# EAGLE design sensor (EAGLE 6.1)
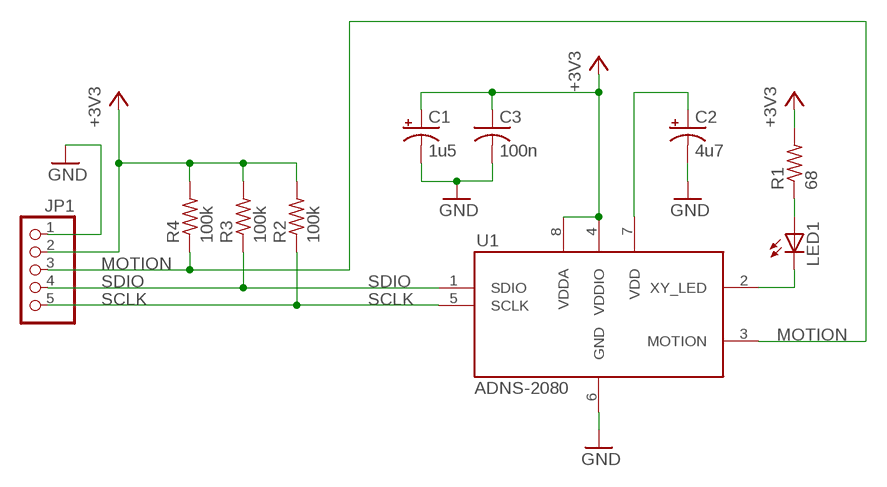
[diagram p0: schematic, sheet 1]

## Parts
C1  1u5  CPOL-USE2.5-5  [E2,5-5]
C2  4u7  CPOL-USE2.5-5  [E2,5-5]
C3  100n  C-US025-025X050  [C025-025X050]
JP1  PINHD-1X5  [1X05]
LED1  LED5MM  [LED5MM]
R1  68  R-US_0207/7  [0207/7]
R2  100k  R-US_0204/5  [0204/5]
R3  100k  R-US_0204/5  [0204/5]
R4  100k  R-US_0204/5  [0204/5]
U1  ADNS-2080  [DIP8-OPTICAL]

## Nets
+3V3: C1.+ C3.1 JP1.2 R1.2 R2.2 R3.2 R4.2 U1.4(VDDIO) U1.8(VDDA)
GND: C1.- C2.- C3.2 JP1.1 U1.6(GND)
MOTION: JP1.3 R4.1 U1.3(MOTION)
N$2: C2.+ U1.7(VDD)
N$5: LED1.A R1.1
N$6: LED1.K(C) U1.2(XY_LED)
SCLK: JP1.5 R2.1 U1.5(SCLK)
SDIO: JP1.4 R3.1 U1.1(SDIO)

## Library data of the parts
C1 C2 = rcl:CPOL-US: POLARIZED CAPACITOR, American symbol
C3 = rcl:C-US: CAPACITOR, American symbol
JP1 = pinhead:PINHD-1X5: PIN HEADER
LED1 = led:LED: LED OSRAM: - CHIPLED LG R971, LG N971, LY N971, LG Q971, LY Q971, LO R971, LY R971 LH N974, LH R974 LS Q976, LO Q976, LY Q976 LO Q996 - Hyper CHIPLED LW Q18S LB Q993, LB Q99A, LB R99A - SideLED LS A670, LO A670, LY A670, LG A670, LP A670 LB A673, LV A673, LT A673, LW A673 LH A674 LY A675 LS A676, LA A676, LO A676, LY A676, LW A676 LS A679, LY A679, LG A679 - Hyper Micro SIDELED® LS Y876, LA Y876, LO Y876, LY Y876 LT Y87S - SmartLED LW L88C, LW L88S LB L89C, LB L89S, LG L890 LS L89K, LO L89K, LY L89K LS L896, LA L896, LO L896, LY L896 - TOPLED LS T670, LO T670, LY T670, LG T670, LP T670 LSG T670, LSP T670, LSY T670, LOP T670, LYG T670 LG T671, LOG T671, LSG T671 LB T673, LV T673, LT T673, LW T673 LH T674 LS T676, LA T676, LO T676, LY T676, LB T676, LH T676, LSB T676, LW T676 LB T67C, LV T67C, LT T67C, LS T67K, LO T67K, LY T67K, LW E67C LS E67B, LA E67B, LO E67B, LY E67B, LB E67C, LV E67C, LT E67C LW T67C LS T679, LY T679, LG T679 LS T770, LO T770, LY T770, LG T770, LP T770 LB T773, LV T773, LT T773, LW T773 LH T774 LS E675, LA E675, LY E675, LS T675 LS T776, LA T776, LO T776, LY T776, LB T776 LHGB T686 LT T68C, LB T68C - Hyper Mini TOPLED® LB M676 - Mini TOPLED Santana® LG M470 LS M47K, LO M47K, LY M47K Source: http://www.osram.convergy.de LUXEON: - LUMILED® LXK2-PW12-R00, LXK2-PW12-S00, LXK2-PW14-U00, LXK2-PW14-V00 LXK2-PM12-R00, LXK2-PM12-S00, LXK2-PM14-U00 LXK2-PE12-Q00, LXK2-PE12-R00, LXK2-PE12-S00, LXK2-PE14-T00, LXK2-PE14-U00 LXK2-PB12-K00, LXK2-PB12-L00, LXK2-PB12-M00, LXK2-PB14-N00, LXK2-PB14-P00, LXK2-PB14-Q00 LXK2-PR12-L00, LXK2-PR12-M00, LXK2-PR14-Q00, LXK2-PR14-R00 LXK2-PD12-Q00, LXK2-PD12-R00, LXK2-PD12-S00 LXK2-PH12-R00, LXK2-PH12-S00 LXK2-PL12-P00, LXK2-PL12-Q00, LXK2-PL12-R00 Source: www.luxeon.com KINGBRIGHT: KA-3528ASYC Source: www.kingbright.com
R1-R4 = rcl:R-US_: RESISTOR, American symbol
U1 = avago_local:ADNS-2080

## Board
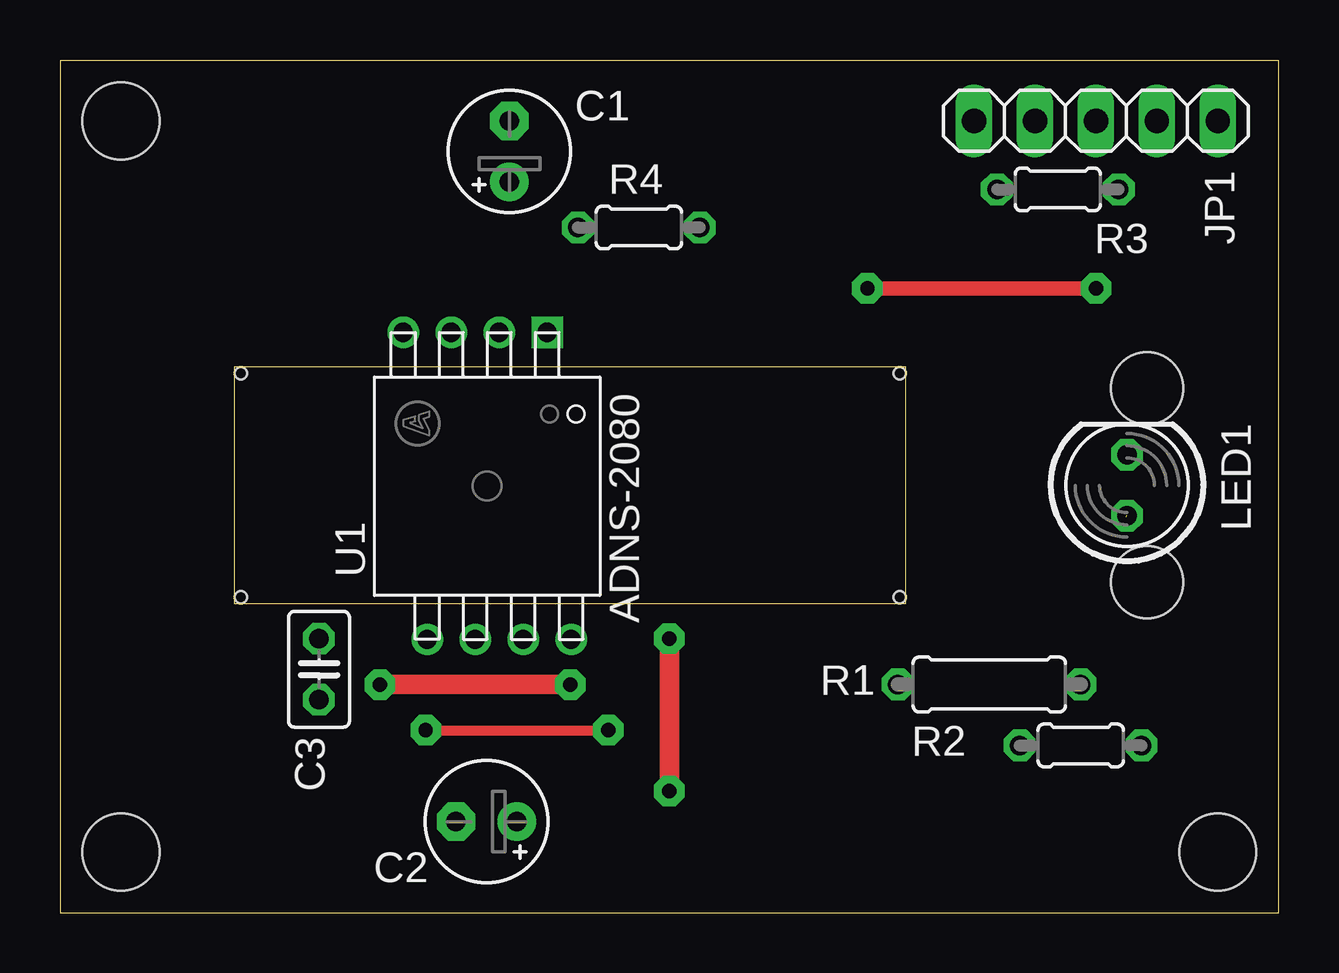
[diagram p1: board, top side]
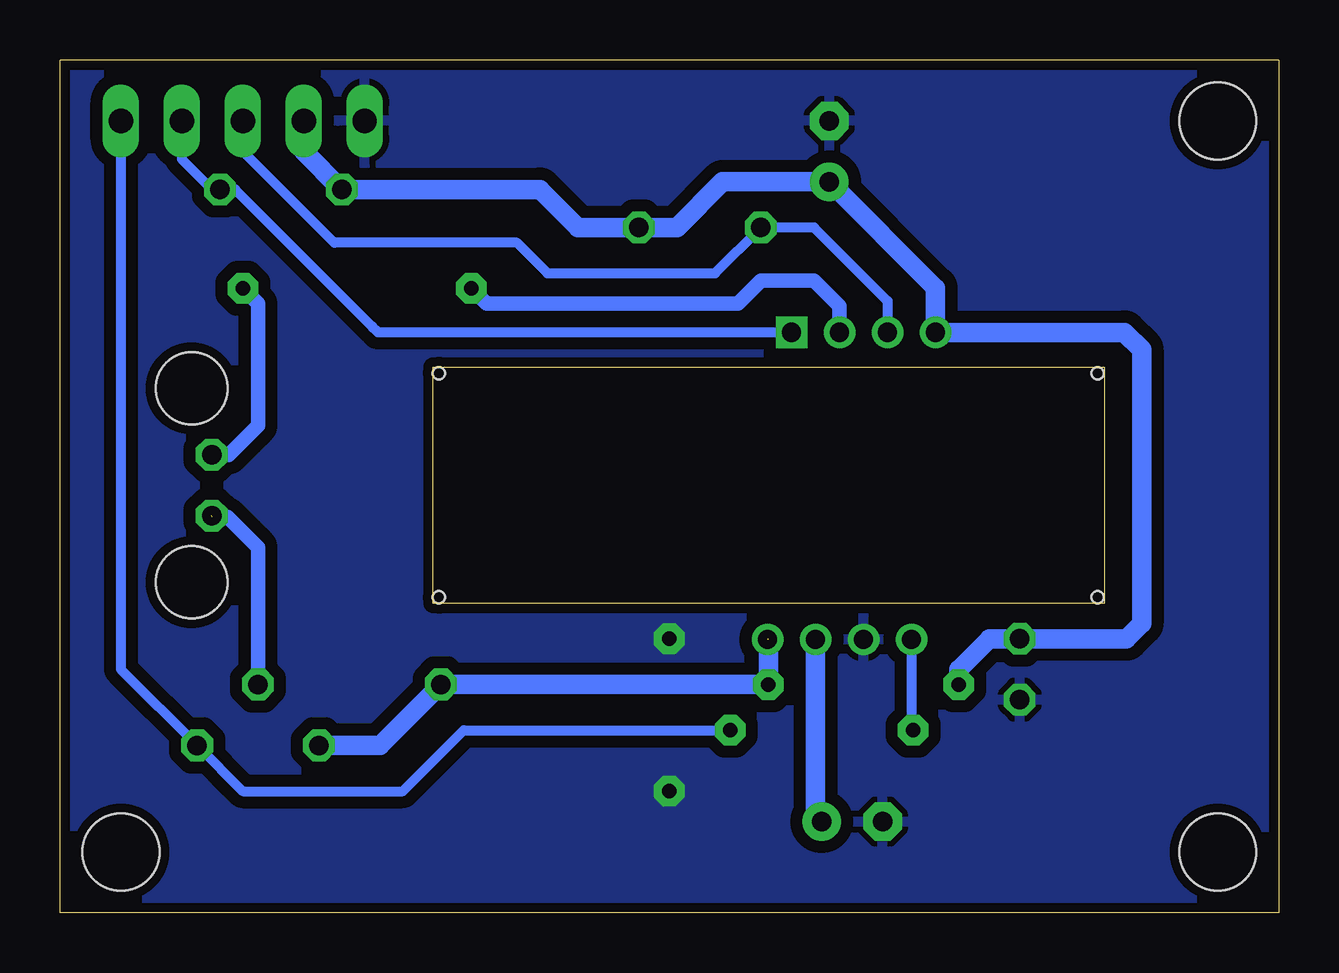
[diagram p2: board, bottom side, seen from below]

Size 50.8 x 35.56 mm. Coordinates in mm from the lower left corner, seen from the top.
Outline: 0,0 50.8,0 50.8,35.56 0,35.56 0,0
Copper layers (1*16): Top 0.035mm / dielectric 1.5mm / Bottom 0.035mm
Design rules: minimum track width 16mil, minimum drill 10mil, track to track 20mil, track to pad 20mil, pad to pad 20mil, via to via 20mil, smd to smd 20mil, copper to edge 16mil, drill to drill 8mil, minimum pad ring 10mil, minimum via ring 8mil, stop-mask expansion 4mil, vias tented up to drill 0mil, thermal gap 10mil
Holes 3 mm at 45.31,21.87 45.31,13.79
Holes 0.51 mm at 7.54,22.5 7.54,13.16 35,22.5 35,13.16
Holes 3.2 mm at 2.54,33.02 2.54,2.54 48.26,2.54
tKeepout: area 34.8,11.2 to 46.3,24.4

### Footprints (pad centres in the part's own frame; a part is rotated, then mirrored left to right if it is on the bottom)
E2,5-5 = drill 0.813 pad 1.6: + -1.27,0 | drill 0.813 pad 1.6 octagon: - 1.27,0
C025-025X050 = drill 0.813 octagon: 1 -1.27,0; 2 1.27,0
1X05 = drill 1.016 long: 1 -5.08,0; 2 -2.54,0; 3 0,0; 4 2.54,0; 5 5.08,0
LED5MM = drill 0.813 octagon: A -1.27,0; K 1.27,0
0207/7 = drill 0.813 octagon: 1 -3.81,0; 2 3.81,0
0204/5 = drill 0.813 octagon: 1 -2.54,0; 2 2.54,0
DIP8-OPTICAL = drill 0.8 square: 1 6.4,-2.5 | drill 0.8: 2 6.4,-0.5; 3 6.4,1.5; 4 6.4,3.5; 5 -6.4,2.5; 6 -6.4,0.5; 7 -6.4,-1.5; 8 -6.4,-3.5

### Placement (x,y rotation side)
C1  18.73,31.75 90 top
C2  17.78,3.81 180 top
C3  10.79,10.16 270 top
JP1  43.18,33.02 0 top
LED1  44.48,17.83 90 top
R1  38.73,9.53 180 top
R2  42.55,6.99 180 top
R3  41.59,30.16 180 top
R4  24.13,28.57 0 top
U1  17.81,17.81 90 top

### Tracks (layer width: path | path; a pad name or v marks a point on that pad's centre or on a via)
+3V3  (via drill 0.6 pad 1.27)  (1 unrouted)
  Top 0.813: v13.34,9.53 v21.27,9.53
  Bottom 0.813: JP1.2 40.64,31.75 R3.2 30.8,30.16 29.21,28.57 R4.2 25.08,28.57 23.18,30.48 C1.+ 14.3,26.05 U1.4 6.42,24.2 5.71,23.5 5.71,12.06 6.35,11.43 C3.1 12.06,11.43 13.34,10.16 v13.34,9.53 | R2.2 37.47,6.99 R1.2 v21.27,9.53 21.27,11.4
GND  (via drill 0.6 pad 1.27)
  Top 0.813: v25.4,11.43 v25.4,5.08
  pour Bottom: 0,35.56 0,0 50.8,0 50.8,35.56
MOTION
  Bottom 0.406: JP1.3 43.18,31.75 39.37,27.94 31.75,27.94 30.48,26.67 23.5,26.67 R4.1 19.37,28.57 16.3,25.51 U1.3
N$2
  Bottom 0.813: U1.7 19.3,4.07 C2.+
N$5  (1 unrouted)
  Bottom 0.61: R1.1 42.55,15.24 43.81,16.51 44.45,16.51
N$6  (via drill 0.6 pad 1.27)
  Top 0.61: v43.18,26.04 v33.66,26.04
  Bottom 0.61: LED1.K 43.76,19.1 42.55,20.32 42.55,25.4 v43.18,26.04 | v33.66,26.04 33.02,25.4 22.54,25.4 21.59,26.35 19.37,26.35 18.3,25.29 U1.2
SCLK  (via drill 0.6 pad 1.27)
  Top 0.406: v15.24,7.62 v22.86,7.62
  Bottom 0.406: JP1.5 48.26,10.16 R2.1 43.18,5.08 36.51,5.08 33.97,7.62 v22.86,7.62 | U1.5 15.3,7.68 v15.24,7.62
SDIO
  Bottom 0.406: JP1.4 45.72,31.43 44.45,30.16 R3.1 43.5,30.16 37.78,24.45 37.57,24.23 37.54,24.2 U1.1

### Text on the board
Document: 1 | 1 GND | 2 3V3 | 3 MOTION | 4 SDIO | 5 SCLK